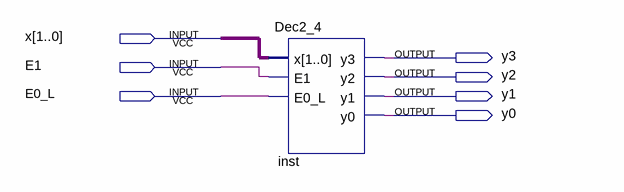
[diagram p0: schematic sheet]
// Quartus schematic DecoderDemo.bdf as structural Verilog: 1 symbols, 7 pins
module DecoderDemo (
  input  [1:0] x,
  input  E1,
  input  E0_L,
  output y3,
  output y2,
  output y1,
  output y0
);

  Dec2_4 inst (.x(x), .E1(E1), .E0_L(E0_L), .y3(y3), .y2(y2), .y1(y1), .y0(y0));
endmodule
